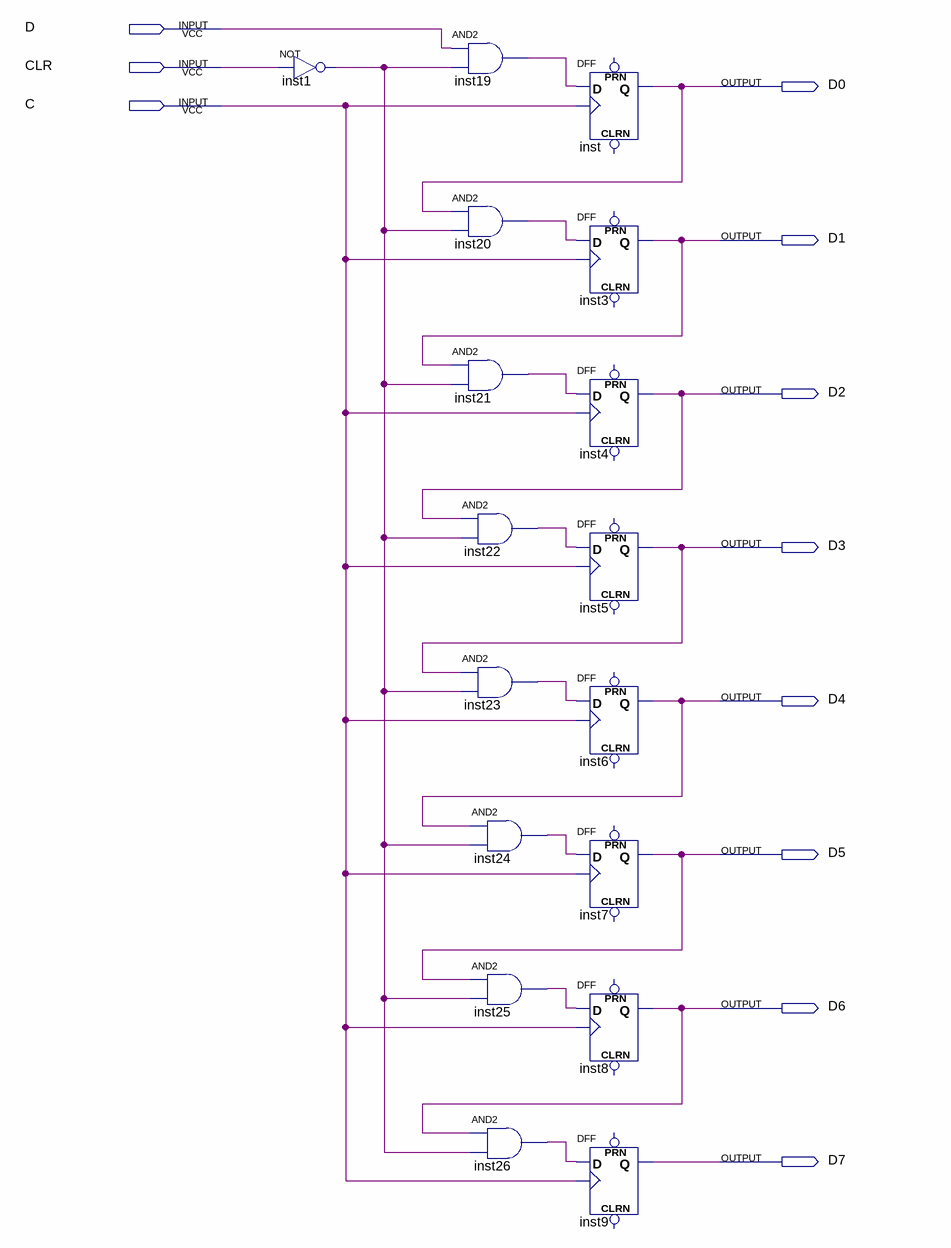
[diagram p0: schematic sheet]
// Quartus schematic Lab_1.bdf as structural Verilog: 17 symbols, 11 pins
module Lab_1 (
  input  D,
  input  CLR,
  input  C,
  output D0,
  output D1,
  output D2,
  output D3,
  output D4,
  output D5,
  output D6,
  output D7
);

  wire inst1_out, inst19_out, inst20_out, inst21_out, inst22_out, inst23_out, inst24_out, inst25_out,
       inst26_out;

  not inst1 (inst1_out, CLR);
  and inst19 (inst19_out, D, inst1_out);
  and inst20 (inst20_out, D0, inst1_out);
  and inst21 (inst21_out, D1, inst1_out);
  and inst22 (inst22_out, D2, inst1_out);
  and inst23 (inst23_out, D3, inst1_out);
  and inst24 (inst24_out, D4, inst1_out);
  and inst25 (inst25_out, D5, inst1_out);
  and inst26 (inst26_out, D6, inst1_out);
  DFF inst (.CLK(C), .D(inst19_out), .Q(D0));  // open: CLRN, PRN
  DFF inst3 (.CLK(C), .D(inst20_out), .Q(D1));  // open: CLRN, PRN
  DFF inst4 (.CLK(C), .D(inst21_out), .Q(D2));  // open: CLRN, PRN
  DFF inst5 (.CLK(C), .D(inst22_out), .Q(D3));  // open: CLRN, PRN
  DFF inst6 (.CLK(C), .D(inst23_out), .Q(D4));  // open: CLRN, PRN
  DFF inst7 (.CLK(C), .D(inst24_out), .Q(D5));  // open: CLRN, PRN
  DFF inst8 (.CLK(C), .D(inst25_out), .Q(D6));  // open: CLRN, PRN
  DFF inst9 (.CLK(C), .D(inst26_out), .Q(D7));  // open: CLRN, PRN
endmodule
